# Altium schematic sheet Top Level (7).SchDoc
size A4; SheetNumber: 1; SheetTotal: 4
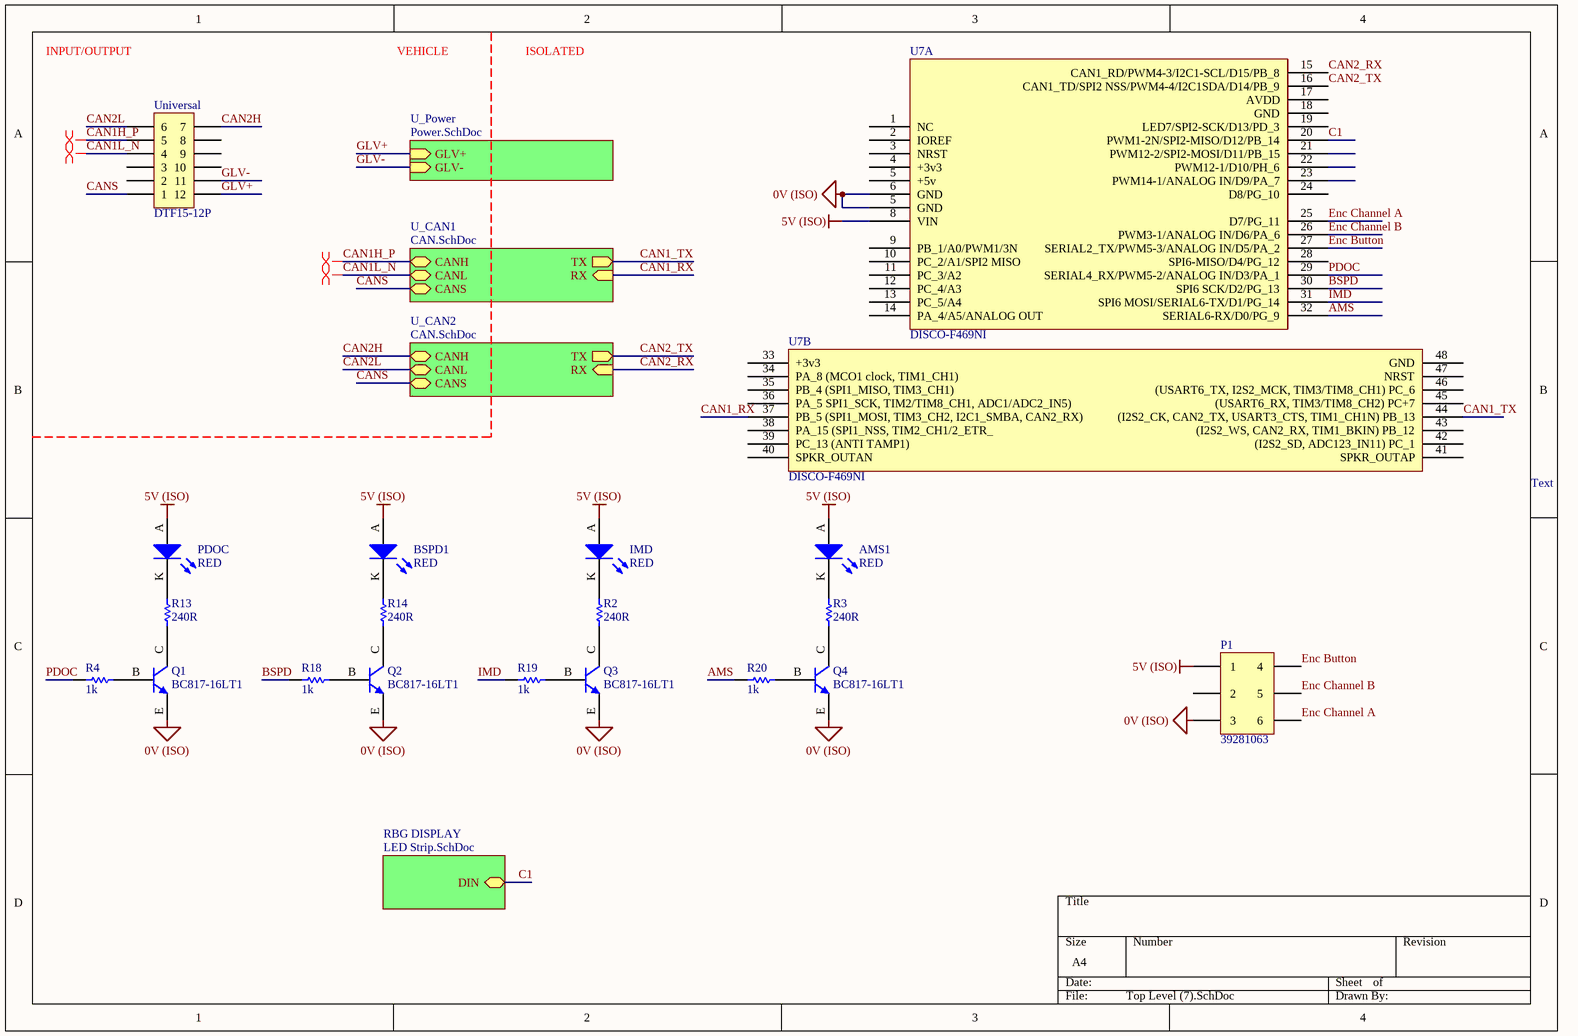
[diagram p0: Top Level (7).SchDoc]

## Parts
AMS1  RED  [5MM LED]
BSPD1  RED  [5MM LED]
IMD  RED  [5MM LED]
P1  39281063  [39281063]
PDOC  RED  [5MM LED]
Q1  BC817-16LT1  [ON SOT-23 BJT]
Q2  BC817-16LT1  [ON SOT-23 BJT]
Q3  BC817-16LT1  [ON SOT-23 BJT]
Q4  BC817-16LT1  [ON SOT-23 BJT]
R2  240R  [0805]
R3  240R  [0805]
R4  1k  [0805]
R13  240R  [0805]
R14  240R  [0805]
R18  1k  [0805]
R19  1k  [0805]
R20  1k  [0805]
U7  DISCO-F469NI  [DISCO-F469NI]  (parts A,B of 2)
Universal  DTF15-12P  [DTF15-12P]

## Sub-sheets
RBG DISPLAY = LED Strip.SchDoc: DIN (bidir)
U_CAN1 = CAN.SchDoc: CANH (bidir), CANL (bidir), CANS (bidir), RX (in), TX (out)
U_CAN2 = CAN.SchDoc: CANH (bidir), CANL (bidir), CANS (bidir), RX (in), TX (out)
U_Power = Power.SchDoc: GLV+ (in), GLV- (in)

## Nets
0V (ISO): P1.3 Q1.E Q2.E Q3.E Q4.E U7.5(GND) U7.6(GND)
5V (ISO): AMS1.A BSPD1.A IMD.A P1.1 PDOC.A U7.8(VIN)
AMS: R20.1 U7.32(SERIAL6-RX/D0/PG_9)
BSPD: R18.1 U7.30(SPI6_SCK/D2/PG_13)
C1: U7.20(PWM1-2N/SPI2-MISO/D12/PB_14) ; sheet RBG DISPLAY/DIN
CAN1_RX: U7.37(PB_5_(SPI1_MOSI,_TIM3_CH2,_I2C1_SMBA,_CAN2_RX)) ; sheet U_CAN1/RX
CAN1_TX: U7.44((I2S2_CK,_CAN2_TX,_USART3_CTS,_TIM1_CH1N)_PB_13) ; sheet U_CAN1/TX
CAN1H_P: Universal.5 ; sheet U_CAN1/CANH
CAN1L_N: Universal.4 ; sheet U_CAN1/CANL
CAN2_RX: U7.15(CAN1_RD/PWM4-3/I2C1-SCL/D15/PB_8) ; sheet U_CAN2/RX
CAN2_TX: U7.16(CAN1_TD/SPI2_NSS/PWM4-4/I2C1SDA/D14/PB_9) ; sheet U_CAN2/TX
CAN2H: Universal.7 ; sheet U_CAN2/CANH
CAN2L: Universal.6 ; sheet U_CAN2/CANL
CANS: Universal.1 ; sheet U_CAN2/CANS, sheet U_CAN1/CANS
Enc Button: P1.4 U7.27(SERIAL2_TX/PWM5-3/ANALOG_IN/D5/PA_2)
Enc Channel A: P1.6 U7.25(D7/PG_11)
Enc Channel B: P1.5 U7.26(PWM3-1/ANALOG_IN/D6/PA_6)
GLV+: Universal.12 ; sheet U_Power/GLV+
GLV-: Universal.11 ; sheet U_Power/GLV-
IMD: R19.1 U7.31(SPI6_MOSI/SERIAL6-TX/D1/PG_14)
PDOC: R4.1 U7.29(SERIAL4_RX/PWM5-2/ANALOG_IN/D3/PA_1)
NetAMS1_K: AMS1.K R3.2
NetBSPD1_K: BSPD1.K R14.2
NetIMD_K: IMD.K R2.2
NetPDOC_K: PDOC.K R13.2
NetQ1_B: Q1.B R4.2
NetQ1_C: Q1.C R13.1
NetQ2_B: Q2.B R18.2
NetQ2_C: Q2.C R14.1
NetQ3_B: Q3.B R19.2
NetQ3_C: Q3.C R2.1
NetQ4_B: Q4.B R20.2
NetQ4_C: Q4.C R3.1

Not connected (* = marked no-connect by the designer): P1 2; U7 1(NC) 2(IOREF) 3(NRST) 4(+3v3) 9(PB_1/A0/PWM1/3N) 10(PC_2/A1/SPI2_MISO) 11(PC_3/A2) 12(PC_4/A3) 13(PC_5/A4) 14(PA_4/A5/ANALOG_OUT) 17(AVDD) 18(GND) 19(LED7/SPI2-SCK/D13/PD_3) 21(PWM12-2/SPI2-MOSI/D11/PB_15) 22(PWM12-1/D10/PH_6) 23(PWM14-1/ANALOG_IN/D9/PA_7) 24(D8/PG_10) 28(SPI6-MISO/D4/PG_12) 33(+3v3) 34(PA_8_(MCO1_clock,_TIM1_CH1)) 35(PB_4_(SPI1_MISO,_TIM3_CH1)) 36(PA_5_SPI1_SCK,_TIM2/TIM8_CH1,_ADC1/ADC2_IN5)) 38(PA_15_(SPI1_NSS,_TIM2_CH1/2_ETR_) 39(PC_13_(ANTI_TAMP1)) 40(SPKR_OUTAN) 41(SPKR_OUTAP) 42((I2S2_SD,_ADC123_IN11)_PC_1) 43((I2S2_WS,_CAN2_RX,_TIM1_BKIN)_PB_12) 45((USART6_RX,_TIM3/TIM8_CH2)_PC+7) 46((USART6_TX,_I2S2_MCK,_TIM3/TIM8_CH1)_PC_6) 47(NRST) 48(GND); Universal 2 3 8 9 10

## Layout directives
differential pair: CAN1H_P, CAN1L_N

## Notes on the sheet
- INPUT/OUTPUT
- VEHICLE
- ISOLATED
- Text

## Library data of the parts
AMS1 BSPD1 IMD PDOC = C503B-GAN-CB0F0791: LED RED CLEAR 5MM ROUND T/H; Manufacturer: Cree Inc.; Part Number: C503B-GAN-CB0F0791; Colour: Green; Digikey Part Number: C503B-GAN-CB0F0791-ND; Digikey Link: https://www.digikey.com/products/en?mpart=C503B-GAN-CB0F0791&v=90&fbclid=IwAR2JUDlssEKQKztQKB3h34IlXIXn-Voov26K1DpWHwQ6mgzekaFZMifRLJU
P1 = 39281063: Mini-Fit VERT 3x2; Positions: 6; Pitch: 4.20mm; Row Spacing: 4.2mm; Angle: 0; Flange: No; Contact: Gold; Part Number: 39281063; Digikey Part Number: WM3802-ND; Digikey Link: https://www.digikey.com/product-detail/en/molex/0039281063/WM3802-ND/61404
Q1-Q4 = BC817-16LT1: 300mW  BJT NPN Transistor; Manufacturer: ON Semiconductor; Part Number: BC817-16LT1; Digikey Part Number: BC817-16LT1OSTR-ND; Digikey Link: https://www.digikey.com.au/product-detail/en/on-semiconductor/BC817-16LT1/BC817-16LT1OSTR-ND/606178
R2 R3 R13 R14 = RC0805FR07240RL: Manufacturer: YAGEO; Tolerance: 0.01; Rated Voltage: 0.125W; Part Number: RC0805FR07240RL; Value: 240R; Material: FR-07; qty: 50
R4 R18-R20 = RC0805FR071KL: Manufacturer: YAGEO; Tolerance: 0.01; Rated Voltage: 0.125W; Part Number: RC0805FR071KL; Value: 1k; Material: FR-07; qty: 50
U7 = DISCO-F469NI: STM32F469 Discovery STM32F4 ARM® Cortex®-M4 MCU 32-Bit Embedded Evaluation Board  (The Disco 69 lol); Manufacturer: STMicroelectronics; Part Number: DISCO-F469NI; Digikey Part Number: 497-15990-ND; Digikey Link: https://www.digikey.com/product-detail/en/stmicroelectronics/STM32F469I-DISCO/497-15990-ND/5428811
Universal = DTF15-12P[[/\]]DTF15-12P: Positions: 12; Pitch: 4.44mm; Row Spacing: 9.12 mm; Angle: 0; Flange: No; Contact: Copper Alloy; Part Number: DTF15-12P; Digikey Part Number: 1734-1647-ND; Digikey Link: https://www.digikey.com.au/product-detail/en/te-connectivity-deutsch-connectors/DTF15-12PA/1734-1647-ND/7220164